# Altium schematic sheet LightSensors.SchDoc
size A4
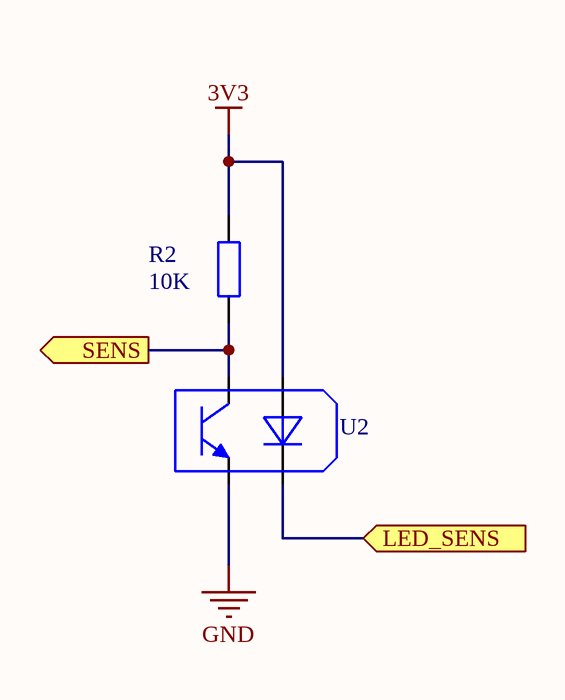
[diagram p0: LightSensors.SchDoc]

## Parts
R2  10K  [FP_0805_RES]
U2  TCRT5000  [TCRT5000_NO_HOLE]  (value not drawn)

## Ports
LED_SENS (in), SENS (out)

## Nets
3V3: R2.2 U2.A
GND: U2.E
LED_SENS: U2.K ; port LED_SENS
SENS: R2.1 U2.C ; port SENS

## Library data of the parts
R2 = RES 10K: Resistor; Tolerance: 5%; Power: 125mW; Name: YAGEO (PHYCOMP)  RC0805JR-0710KL  SMD Chip Resistor, Thick Film, 10 kohm; Reference: 9234136; Supplier: Farnell; Value: 10K
U2 = TCRT5000: Reflective Photo Interrupter, Phototransistor, Through Hole, 15 mm, 60 mA, 5 Vr, 1.25 Vf